# EAGLE schematic switches (EAGLE 8.2.0)
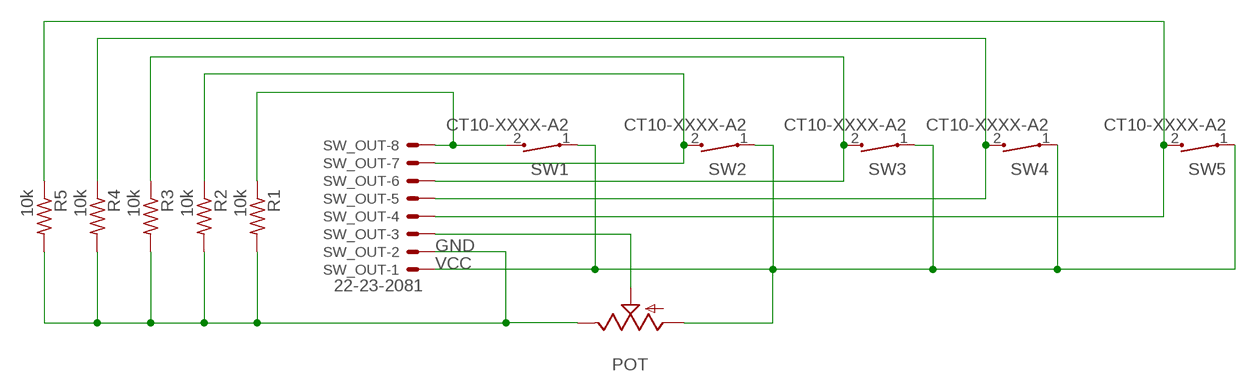
[diagram p0: schematic, sheet 1]

## Parts
POT  TRIM_US-3223G  [3223G]
R1  10k  R-US_0204/2V  [0204V]
R2  10k  R-US_0204/2V  [0204V]
R3  10k  R-US_0204/2V  [0204V]
R4  10k  R-US_0204/2V  [0204V]
R5  10k  R-US_0204/2V  [0204V]
SW1  CT10-XXXX-A2  [CT10-XXXX-A2]
SW2  CT10-XXXX-A2  [CT10-XXXX-A2]
SW3  CT10-XXXX-A2  [CT10-XXXX-A2]
SW4  CT10-XXXX-A2  [CT10-XXXX-A2]
SW5  CT10-XXXX-A2  [CT10-XXXX-A2]
SW_OUT  22-23-2081  [22-23-2081]

## Nets
GND: POT.3(E) R1.2 R2.2 R3.2 R4.2 R5.2 SW_OUT.2
N$1: R5.1 SW5.2 SW_OUT.4
N$2: POT.2(S) SW_OUT.3
N$3: R1.1 SW1.2 SW_OUT.8
N$4: R2.1 SW2.2 SW_OUT.7
N$5: R3.1 SW3.2 SW_OUT.6
N$6: R4.1 SW4.2 SW_OUT.5
VCC: POT.1(A) SW1.1 SW2.1 SW3.1 SW4.1 SW5.1 SW_OUT.1

## Library data of the parts
POT = pot:TRIM_US-: POTENTIOMETER
R1-R5 = resistor:R-US_: RESISTOR, American symbol
SW1-SW5 = switch-coto:CT10-XXXX-: CT10 Series Molded Switch Source: www.cotorelay.com .. Coto_Technology__CT10-1530-G1.pdf
SW_OUT = con-molex:22-23-2081: .100" (2.54mm) Center Header - 8 Pin; MF: MOLEX; MPN: 22-23-2081; OC_FARNELL: 1756826; OC_NEWARK: 01C7592